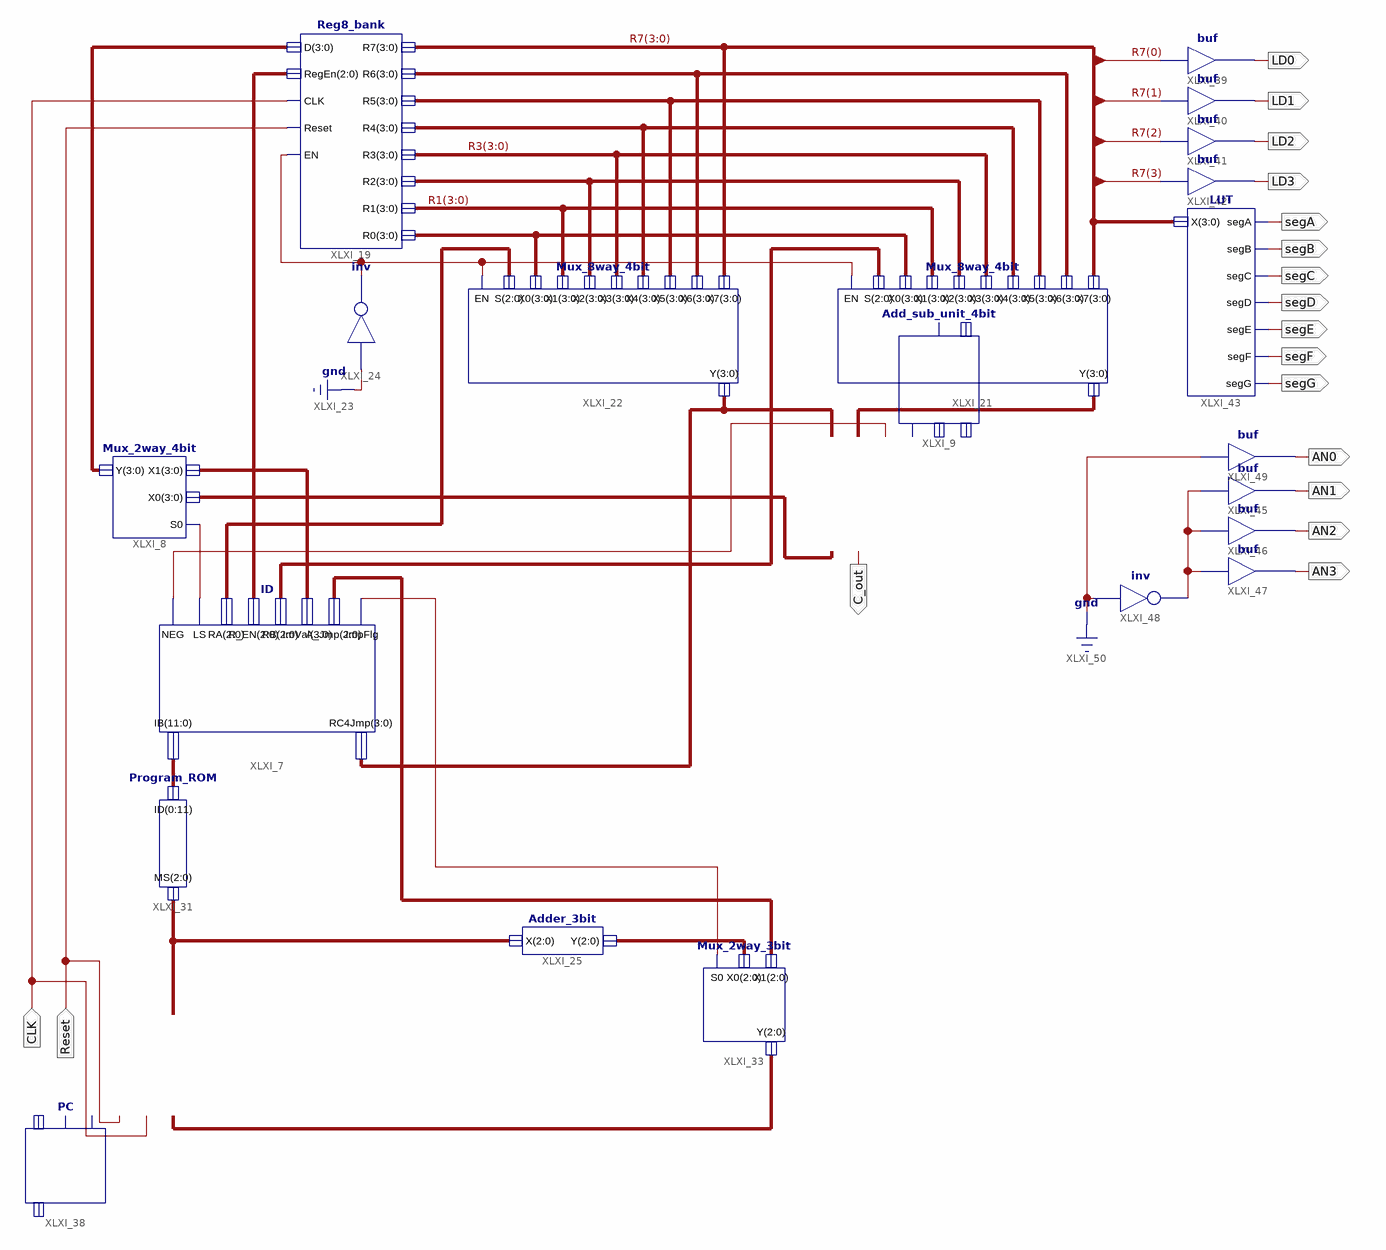
[diagram p0: schematic sheet 1]
// Xilinx ISE schematic NanoProcessor.sch (spartan3e) as structural Verilog: 21 symbols, 18 ports
module NanoProcessor (
  input  Reset,
  input  CLK,
  output C_out,
  output LD0,
  output LD1,
  output LD2,
  output LD3,
  output segA,
  output segB,
  output segC,
  output segD,
  output segE,
  output segF,
  output segG,
  output AN1,
  output AN2,
  output AN3,
  output AN0
);

  wire jmp, XLXN_19, XLXN_35, XLXN_87, XLXN_102;
  wire [2:0] f, Q, XLXN_32, XLXN_83, XLXN_84, XLXN_89, XLXN_90;
  wire [3:0] R0, R1, R3, R4, R5, R6, R7, XLXN_21, XLXN_22, XLXN_34, XLXN_37, XLXN_38, XLXN_92;
  wire [11:0] XLXN_5;

  ID XLXI_7 (
    .IB(XLXN_5), .RC4Jmp(XLXN_38), .NEG(XLXN_35), .LS(XLXN_19), .RA(XLXN_83), .R_EN(XLXN_32), .RB(XLXN_84),
    .ImVal(XLXN_21), .A_Jmp(XLXN_89), .JmpFlg(jmp));
  Mux_2way_4bit XLXI_8 (.S0(XLXN_19), .X0(XLXN_22), .X1(XLXN_21), .Y(XLXN_34));
  Add_sub_unit_4bit XLXI_9 (.A(XLXN_38), .B(XLXN_37), .C_out(C_out), .S(XLXN_35), .Y(XLXN_22));
  Reg8_bank XLXI_19 (
    .Reset(Reset), .CLK(CLK), .D(XLXN_34), .EN(XLXN_87), .RegEn(XLXN_32), .R0(R0), .R2(XLXN_92), .R4(R4),
    .R6(R6), .R7(R7), .R5(R5), .R3(R3), .R1(R1));
  Mux_8way_4bit XLXI_21 (
    .EN(XLXN_87), .S(XLXN_84), .X0(R0), .X1(R1), .X2(XLXN_92), .X3(R3), .X4(R4), .X5(R5), .X6(R6), .X7(R7),
    .Y(XLXN_37));
  Mux_8way_4bit XLXI_22 (
    .EN(XLXN_87), .S(XLXN_83), .X0(R0), .X1(R1), .X2(XLXN_92), .X3(R3), .X4(R4), .X5(R5), .X6(R6), .X7(R7),
    .Y(XLXN_38));
  not XLXI_24 (XLXN_87, 1'b0);
  Adder_3bit XLXI_25 (.X(f), .Y(XLXN_90));
  Program_ROM XLXI_31 (.ID(XLXN_5), .MS(f));
  Mux_2way_3bit XLXI_33 (.S0(jmp), .X0(XLXN_90), .X1(XLXN_89), .Y(Q));
  PC XLXI_38 (.D(Q), .Reset(Reset), .CLK(CLK), .Q(f));
  buf XLXI_39 (LD0, R7[0]);
  buf XLXI_40 (LD1, R7[1]);
  buf XLXI_41 (LD2, R7[2]);
  buf XLXI_42 (LD3, R7[3]);
  LUT XLXI_43 (.segA(segA), .segB(segB), .segC(segC), .segD(segD), .segE(segE), .segF(segF), .segG(segG), .X(R7));
  buf XLXI_45 (AN1, XLXN_102);
  buf XLXI_46 (AN2, XLXN_102);
  buf XLXI_47 (AN3, XLXN_102);
  not XLXI_48 (XLXN_102, 1'b0);
  buf XLXI_49 (AN0, 1'b0);
endmodule
